# EAGLE design 9235HallEffectV1.0 (EAGLE 9.0.0)
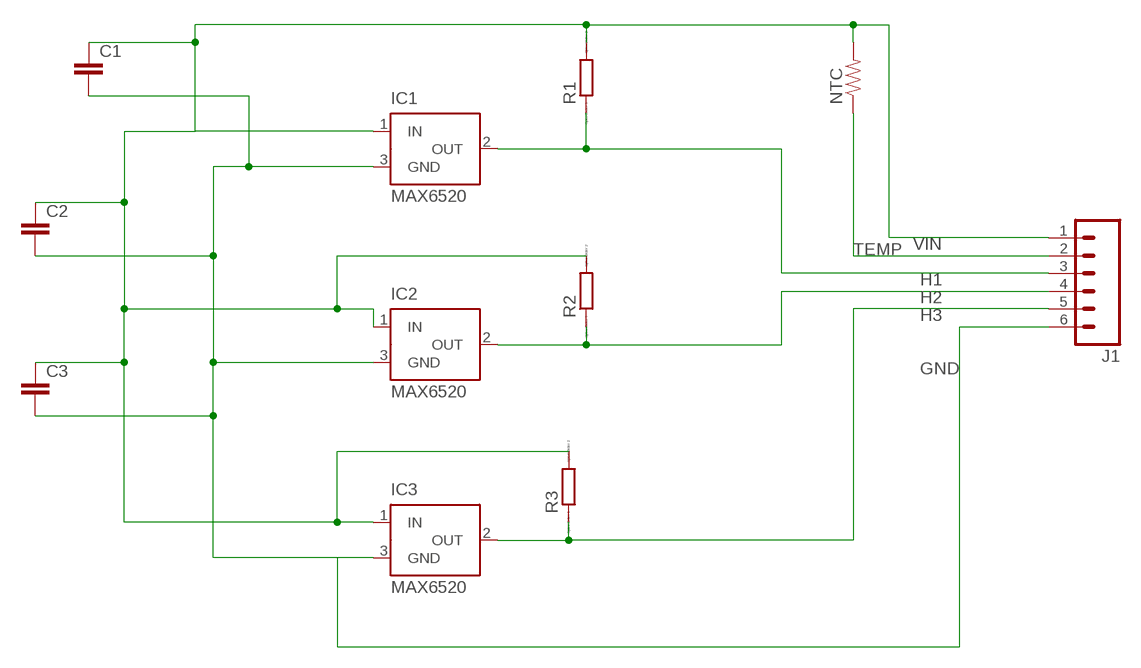
[diagram p0: schematic, sheet 1]

## Parts
C1  C-EUC0603  [C0603]
C2  C-EUC0603  [C0603]
C3  C-EUC0603  [C0603]
IC1  MAX6520  [SOT23]
IC2  MAX6520  [SOT23]
IC3  MAX6520  [SOT23]
J1  M06SMD-1MM  [1X06-1MM]
NTC  RESISTOR0603-RES  [0603-RES]
R1  RR0603  [R0603]
R2  RR0603  [R0603]
R3  RR0603  [R0603]

## Nets
GND: C1.2 C2.2 C3.2 IC1.3(GND) IC2.3(GND) IC3.3(GND) J1.6
H1: IC1.2(OUT) J1.3 R1.1
H2: IC2.2(OUT) J1.4 R2.1
H3: IC3.2(OUT) J1.5 R3.1
TEMP: J1.2 NTC.1
VIN: C1.1 C2.1 C3.1 IC1.1(IN) IC2.1(IN) IC3.1(IN) J1.1 NTC.2 R1.2 R2.2 R3.2

## Library data of the parts
C1-C3 = rcl:C-EU: CAPACITOR, European symbol
IC1-IC3 = maxim:MAX6520: 1.2V Voltage Reference 50ppm/°C, SOT23, 3-Terminal Source: Data sheet <http://datasheets.maxim-ic.com/en/ds/MAX6520.pdf>; MF: MAXIM; MPN: MAX6520EUR-T; OC_FARNELL: unknown; OC_NEWARK: 02J4586
J1 = SparkFun-Connectors:M06: Header 6 Standard 6-pin 0.1" header. Use with straight break away headers (SKU : PRT-00116), right angle break away headers (PRT-00553), swiss pins (PRT-00743), machine pins (PRT-00117), and female headers (PRT-00115). Molex polarized connector foot print use with SKU : PRT-08094 with associated crimp pins and housings. NOTES ON THE VARIANTS LOCK and LOCK_LONGPADS... This footprint was designed to help hold the alignment of a through-hole component (i.e. 6-pin header) while soldering it into place. You may notice that each hole has been shifted either up or down by 0.005 of an inch from it's more standard position (which is a perfectly straight line). This slight alteration caused the pins (the squares in the middle) to touch the edges of the holes. Because they are alternating, it causes a "brace" to hold the component in place. 0.005 has proven to be the perfect amount of "off-center" position when using our standard breakaway headers. Although looks a little odd when you look at the bare footprint, once you have a header in there, the alteration is very hard to notice. Also,if you push a header all the way into place, it is covered up entirely on the bottom side. This idea of altering the position of holes to aid alignment will be further integrated into the Sparkfun Library for other footprints. It can help hold any component with 3 or more connection pins.
NTC = SparkFun-Passives:RESISTOR: Resistor Basic schematic elements and footprints for 0603, 1206, and PTH resistors.
R1-R3 = eagle-ltspice:R: RESISTOR, European symbol; SPICEMODEL: NONE; SPICEPREFIX: R

## Net classes
0 default: width 0.508 mm, clearance 0.508 mm

## Board
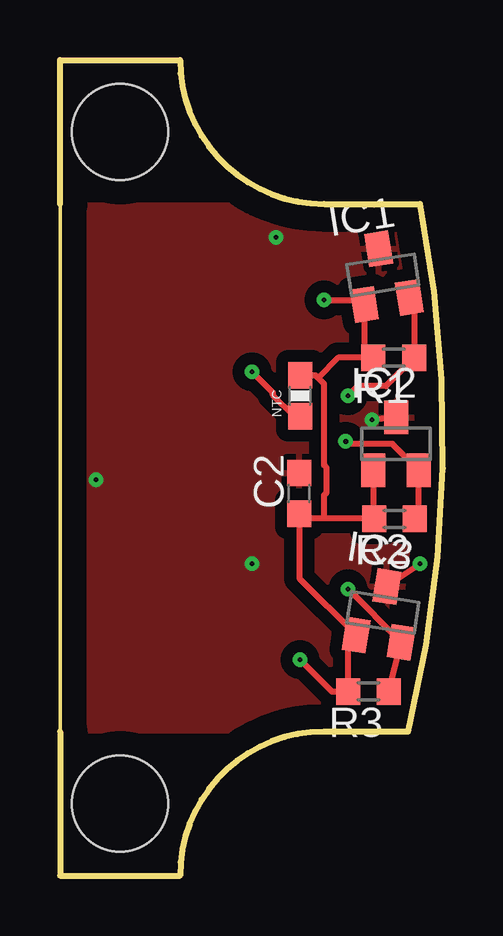
[diagram p1: board, top side]
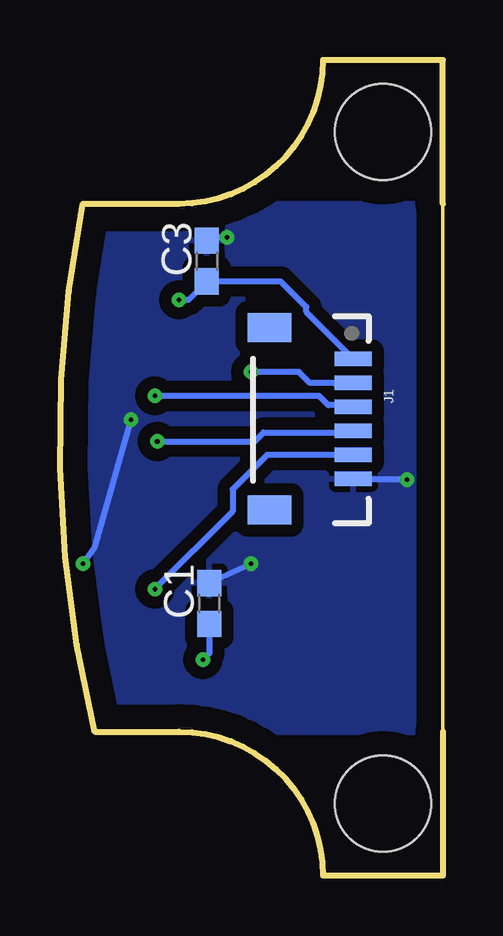
[diagram p2: board, bottom side, seen from below]

Size 15.95 x 34 mm. Coordinates in mm from the lower left corner, seen from the top.
Outline: 14.49,6 14.5,6.01
Outline: 14.5,6 arc25 15,28 11,28 arc-90 5,34 0,34 0,28 0,6 0,0 5,0 arc-90 11,6 14.5,6
Copper layers (1*16): Top 0.035mm / dielectric 1.5mm / Bottom 0.035mm
Design rules "default": minimum track width 6mil, minimum drill 0.35mm, track to track 6mil, track to pad 6mil, pad to pad 6mil, via to via 6mil, smd to smd 6mil, copper to edge 40mil, drill to drill 6mil, minimum pad ring 10mil, minimum via ring 8mil, stop-mask expansion 4mil, vias tented up to drill 0mil, thermal gap 10mil
Holes 4 mm at 2.5,31 2.5,3

### Footprints (pad centres in the part's own frame; a part is rotated, then mirrored left to right if it is on the bottom)
C0603 = smd 1.1 x 1: 1 -0.85,0; 2 0.85,0
SOT23 = smd 1 x 1.4: 1 -0.95,-1.1; 2 0.95,-1.1; 3 0,1.1
1X06-1MM = smd 0.6 x 1.55: 1 -2.54,1.27; 2 -1.54,1.27; 3 -0.54,1.27; 4 0.46,1.27; 5 1.46,1.27; 6 2.46,1.27 | smd 1.2 x 1.8: P$1 -3.84,-2.225; P$2 3.76,-2.225
0603-RES = smd 1.1 x 1: 1 -0.85,0; 2 0.85,0
R0603 = smd 1 x 1.1: 1 -0.85,0; 2 0.85,0

### Placement (x,y rotation side)
C1  9.73,11.34 90 bottom
C2  9.97,15.93 90 top
C3  9.83,25.62 90 bottom
IC1  13.45,25.04 9 top
IC2  14,18 0 top
IC3  13.45,10.96 351 top
J1  5,19 270 bottom
NTC  10,20 90 top
R1  13.91,21.59 180 top
R2  13.94,14.87 180 top
R3  12.85,7.67 180 top

### Tracks (layer width: path | path; a pad name or v marks a point on that pad's centre or on a via)
GND  (via drill 0.2 pad 0.55)
  Top 0.254: IC2.3 v13,19 | v15,13 IC3.3
  Bottom 0.254: J1.6 1.54,16.54 v1.5,16.5 | C3.2 9.69,26.6 v9,26.6 | C1.2 v8,13 | v13,19 14.53,13.65 v15,13
  pour Top: 0,28 17,28 17,6 0,6
  pour Bottom: 0,28 16,28 16,6 0,6
H1  (via drill 0.2 pad 0.55)
  Top 0.254: v12,20 12.41,20.41 13.58,20.41 R1.1 14.76,23.9 IC1.2
  Bottom 0.254: J1.3 3.8,19.61 4.77,19.61 5.16,20 v12,20
H2  (via drill 0.2 pad 0.55)
  Top 0.254: R2.1 14.95,15.03 IC2.2 13.85,18 12,18 v11.9,18.1
  Bottom 0.254: v11.9,18.1 7.84,18.1 7.47,18.48 3.8,18.48 J1.4
H3  (via drill 0.2 pad 0.55)
  Top 0.254: 12,12 v12,11.94 IC3.2 R3.1
  Bottom 0.254: v12,11.94 8.76,15.18 8.76,16.1 7.32,17.54 J1.5
TEMP  (via drill 0.2 pad 0.55)
  Top 0.254: v8,21 8.86,20.13 8.86,20.04 9.75,19.15 NTC.1
  Bottom 0.254: v8,21 6,21 5.54,20.54 J1.2 3.77,20.5 4.5,20.5
VIN  (via drill 0.2 pad 0.55)
  Top 0.254: v11,24 12.49,24 IC1.1 12.68,21.97 R1.2 11.59,21.59 10.75,20.75 | IC2.1 13.05,14.91 | 13.05,14.91 R2.2 | 11,14.91 10.14,14.91 C2.1 9.97,12.39 IC3.1 12,9.68 R3.2 11.33,7.67 v10,9 | 11,14.91 13.05,14.91 | 11,14.91 11,15.86 11.11,15.97 11.11,17 11,17.11 11,20.5 10.75,20.75 | 10.75,20.75 10.65,20.85 NTC.2
  Bottom 0.254: J1.1 5.69,23.5 5.69,23.7 6.76,24.77 C3.1 10.6,24 v11,24 | C1.1 9.73,9.27 v10,9

### Text on the board
200bmp: 9235 / Hall effect / Encoder / v1.0
202bmp: Hughes Electronics